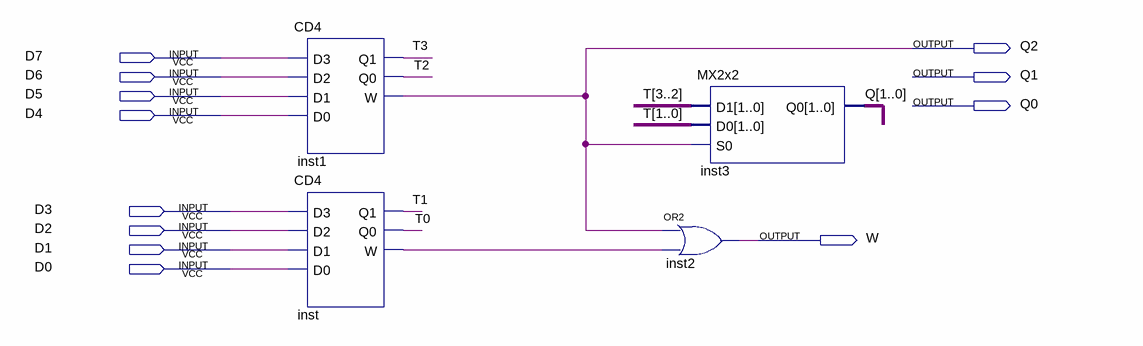
[diagram p0: schematic sheet]
// Quartus schematic CD8.bdf as structural Verilog: 4 symbols, 12 pins
module CD8 (
  input  D7,
  input  D6,
  input  D5,
  input  D4,
  input  D3,
  input  D2,
  input  D1,
  input  D0,
  output Q2,
  output Q1,
  output Q0,
  output W
);

  wire inst_w;
  wire [3:0] T;

  CD4 inst1 (.D3(D7), .D2(D6), .D1(D5), .D0(D4), .Q1(T[3]), .Q0(T[2]), .W(Q2));
  CD4 inst (.D3(D3), .D2(D2), .D1(D1), .D0(D0), .Q1(T[1]), .Q0(T[0]), .W(inst_w));
  or inst2 (W, Q2, inst_w);
  MX2x2 inst3 (.D1(T[3:2]), .D0(T[1:0]), .S0(Q2), .Q0({Q1, Q0}));
endmodule
